# EAGLE design Datalogger-shield_V1.1 (EAGLE 5.11)
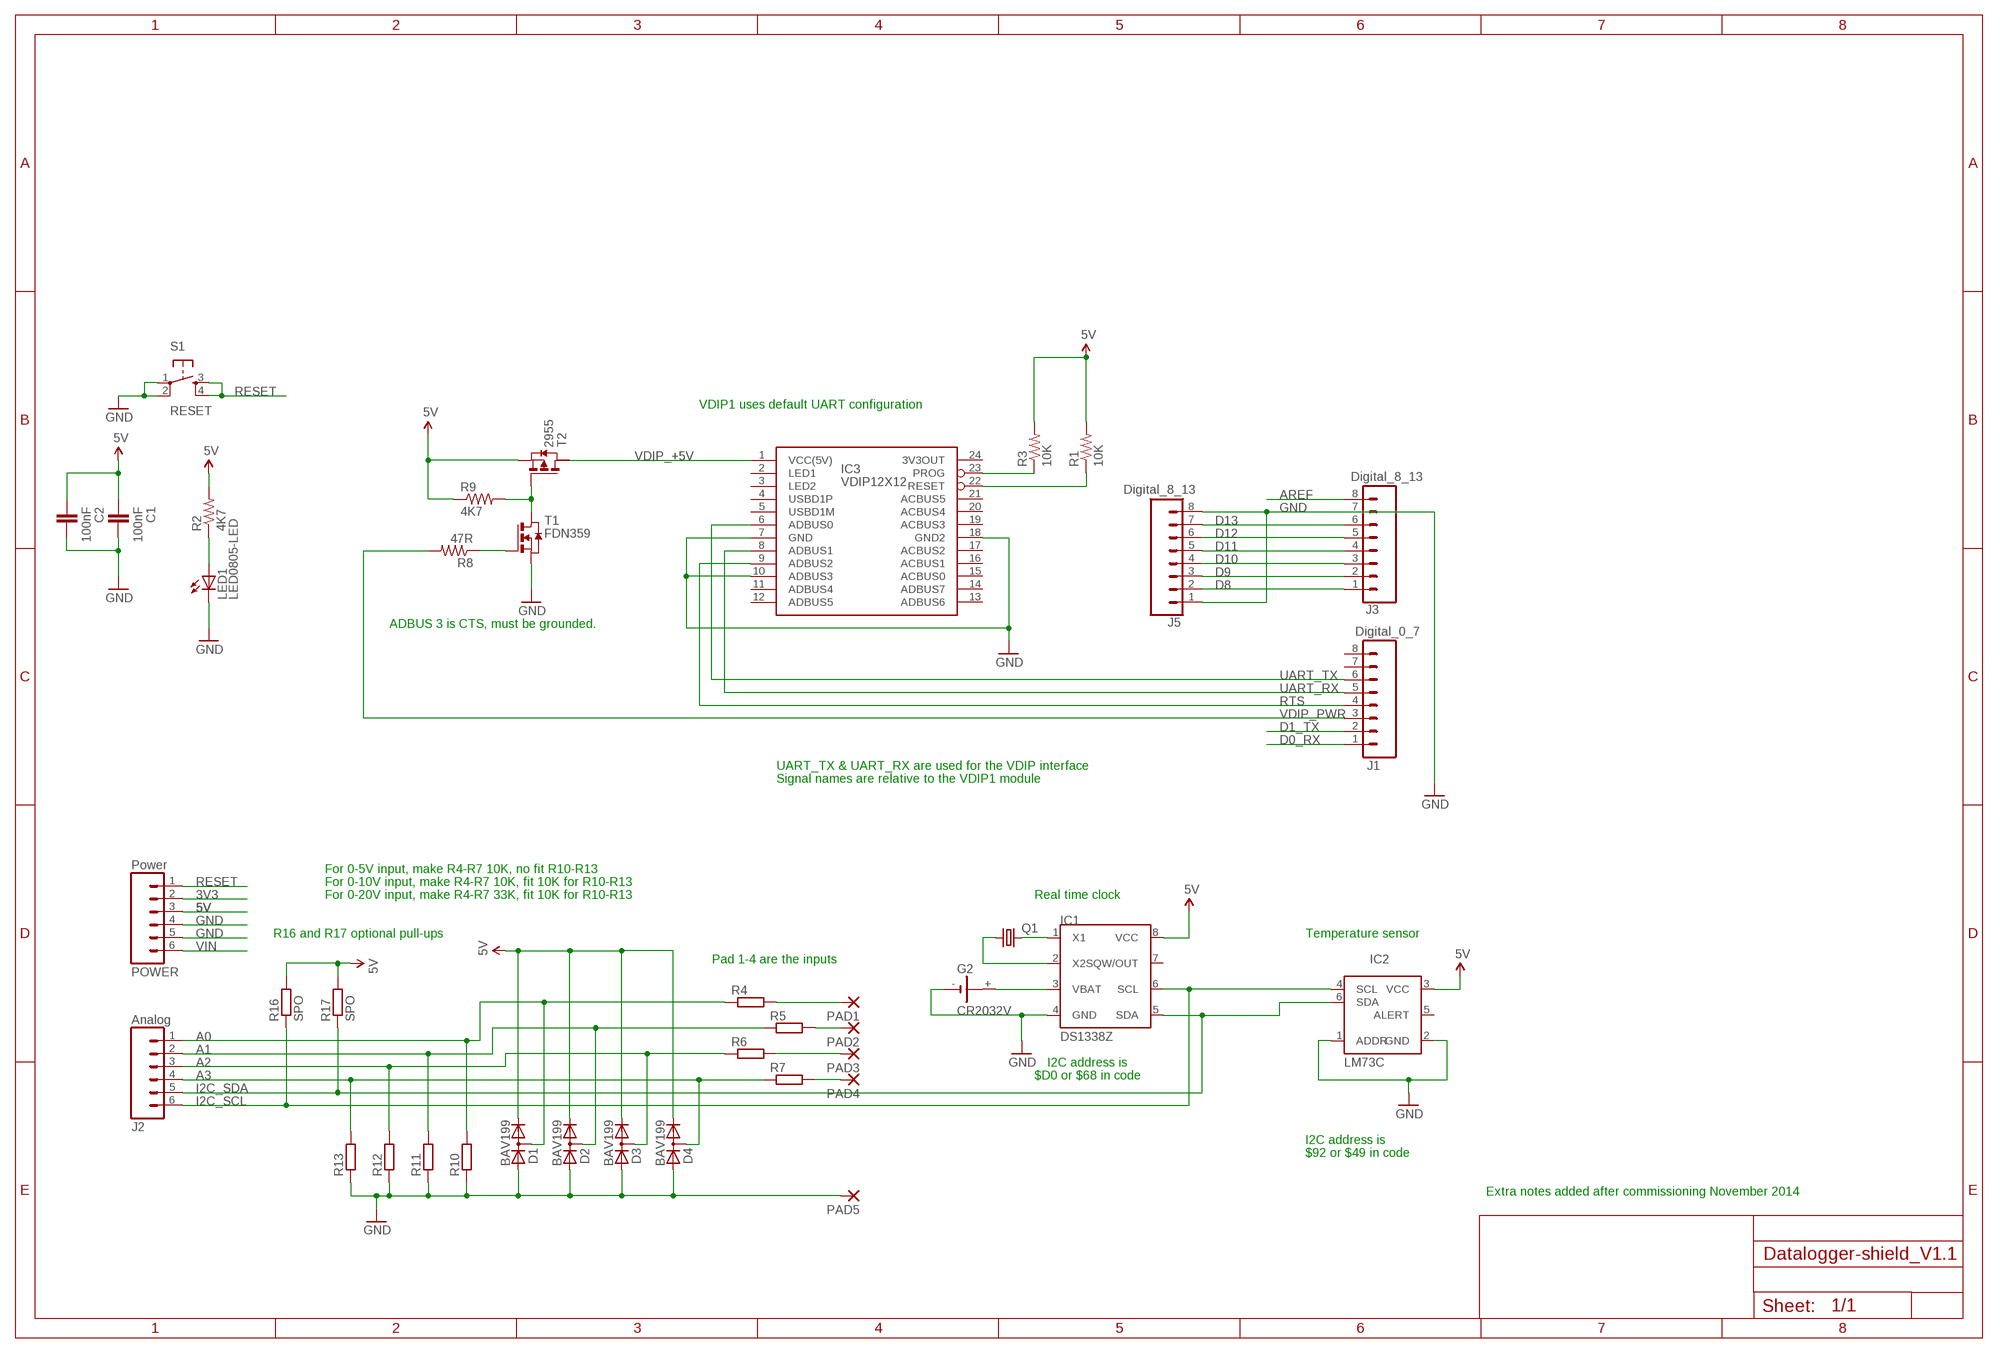
[diagram p0: schematic, sheet 1]

## Parts
C1  100nF  CAP0805-LARGE  [0805-LARGE]
C2  100nF  CAP0805-LARGE  [0805-LARGE]
D1  BAV199  [SOT23]
D2  BAV199  [SOT23]
D3  BAV199  [SOT23]
D4  BAV199  [SOT23]
G2  CR2032V  [CR2032V]
IC1  DS1338Z  DS1307  [SOIC-8]
IC2  LM73C  [SOT23-6L]
IC3  VDIP12X12  [VDIP1-2X12]
J1  Digital_0_7  M08  [1X08]
J2  Analog  M06SIP  [1X06]
J3  Digital_8_13  M08  [1X08]
J5  Digital_8_13  M08  [1X08]
LED1  LED0805-LED  [0805-LED]
PAD1  2,15/1,0  [2,15/1,0]
PAD2  2,15/1,0  [2,15/1,0]
PAD3  2,15/1,0  [2,15/1,0]
PAD4  2,15/1,0  [2,15/1,0]
PAD5  2,15/1,0  [2,15/1,0]
POWER  Power  M06SIP  [1X06]
Q1  CRYSTALTC26H  [TC26H]
R1  10K  RESISTOR0805-LARGE  [0805-LARGE]
R2  4K7  RESISTOR0805-LARGE  [0805-LARGE]
R3  10K  RESISTOR0805-LARGE  [0805-LARGE]
R4  R-EU_R0805  [R0805]
R5  R-EU_R0805  [R0805]
R6  R-EU_R0805  [R0805]
R7  R-EU_R0805  [R0805]
R8  47R  RESISTOR0805-LARGE  [0805-LARGE]
R9  4K7  RESISTOR0805-LARGE  [0805-LARGE]
R10  R-EU_R0805  [R0805]
R11  R-EU_R0805  [R0805]
R12  R-EU_R0805  [R0805]
R13  R-EU_R0805  [R0805]
R16  SPO  R-EU_R0805  [R0805]
R17  SPO  R-EU_R0805  [R0805]
S1  RESET  TAC_SWITCHPTH  [TACTILE-PTH]
T1  FDN359  NMOSSOT23  [SOT-23]
T2  2955  PMOSSOT223  [SOT223]

## Nets
3V3: POWER.2
5V: C1.1 C2.1 D1.2(C) D2.2(C) D3.2(C) D4.2(C) IC1.8(VCC) IC2.3(VCC) POWER.3 R1.2 R2.2 R3.2 R9.1 R16.2 R17.2 T2.3(S)
A0: D1.3(AC) J2.1 R4.1 R10.2
A1: D2.3(AC) J2.2 R5.1 R11.2
A2: D3.3(AC) J2.3 R6.1 R12.2
A3: D4.3(AC) J2.4 R7.1 R13.2
AREF: J3.8
D0_RX: J1.1
D1_TX: J1.2
D8: J3.1 J5.2
D9: J3.2 J5.3
D10: J3.3 J5.4
D11: J3.4 J5.5
D12: J3.5 J5.6
D13: J3.6 J5.7
GND: C1.2 C2.2 D1.1(A) D2.1(A) D3.1(A) D4.1(A) G2.- IC1.4(GND) IC2.1(ADDR) IC2.2(GND) IC3.7(GND) IC3.10(ADBUS3) IC3.18(GND2) J3.7 J5.1 J5.8 LED1.2(C) PAD5.1(P) POWER.4 POWER.5 R10.1 R11.1 R12.1 R13.1 S1.1 S1.2 T1.2(S)
I2C_SCL: IC1.6(SCL) IC2.4(SCL) J2.6 R16.1
I2C_SDA: IC1.5(SDA) IC2.6(SDA) J2.5 R17.1
N$1: IC3.22(RESET) R1.1
N$2: G2.+ IC1.3(VBAT)
N$3: PAD4.1(P) R7.2
N$4: PAD3.1(P) R6.2
N$5: IC1.1(X1) Q1.2
N$6: IC1.2(X2) Q1.1
N$9: PAD2.1(P) R5.2
N$10: PAD1.1(P) R4.2
N$12: R9.2 T1.1(D) T2.1(G)
N$13: R8.1 T1.3(G)
N$89: LED1.1(A) R2.1
N$137: IC3.23(PROG) R3.1
RESET: POWER.1 S1.3 S1.4
RTS: IC3.9(ADBUS2) J1.4
UART_RX: IC3.8(ADBUS1) J1.5
UART_TX: IC3.6(ADBUS0) J1.6
VDIP_+5V: IC3.1(VCC(5V)) T2.2(D)
VDIP_PWR: J1.3 R8.2
VIN: POWER.6
Unconnected: G2.+@1(+) IC1.7(SQW/OUT) IC2.5(ALERT) IC3.2(LED1) IC3.3(LED2) IC3.4(USBD1P) IC3.5(USBD1M) IC3.11(ADBUS4) IC3.12(ADBUS5) IC3.13(ADBUS6) IC3.14(ADBUS7) IC3.15(ACBUS0) IC3.16(ACBUS1) IC3.17(ACBUS2) IC3.19(ACBUS3) IC3.20(ACBUS4) IC3.21(ACBUS5) J1.7 J1.8 T2.4(D2)

## Notes on the sheet
- VDIP1 uses default UART configuration
- ADBUS 3 is CTS, must be grounded.
- UART_TX & UART_RX are used for the VDIP interface
- Signal names are relative to the VDIP1 module
- For 0-5V input, make R4-R7 10K, no fit R10-R13
- For 0-10V input, make R4-R7 10K, fit 10K for R10-R13
- For 0-20V input, make R4-R7 33K, fit 10K for R10-R13 | Real time clock
- R16 and R17 optional pull-ups | Temperature sensor
- Pad 1-4 are the inputs
- I2C address is
- $D0 or $68 in code
- I2C address is
- $92 or $49 in code
- Extra notes added after commissioning November 2014

## Power pins joined to a net without a drawn wire
3V3OUT: IC3.24(3V3OUT)

## Library data of the parts
C1 C2 = SparkFun:CAP: Capacitor Standard 0603 ceramic capacitor, and 0.1" leaded capacitor.
D1-D4 = diode:BAV199: DIODE low-leakage double diode
G2 = battery:CR2032V: LI BATTERY Varta
IC1 = dallas:DS1307: I2C Serial RTC w/56 bytes battery backed RAM
IC2 = IANS:LM73C: I2C/SMBUS Temperature sensor. 6 pin SOT 23 package. 1.0C accuracy and 11-14 bit resolution
IC3 = PracticalArduino:VDIP1
J1 J3 J5 = SparkFun:M08: Header 8 Standard 8-pin 0.1" header. Use with straight break away headers (SKU : PRT-00116), right angle break away headers (PRT-00553), swiss pins (PRT-00743), machine pins (PRT-00117), and female headers (PRT-00115).
J2 POWER = SparkFun:M06: Header 6 Standard 6-pin 0.1" header. Use with straight break away headers (SKU : PRT-00116), right angle break away headers (PRT-00553), swiss pins (PRT-00743), machine pins (PRT-00117), and female headers (PRT-00115). Molex polarized connector foot print use with SKU : PRT-08094 with associated crimp pins and housings. NOTES ON THE VARIANTS LOCK and LOCK_LONGPADS... This footprint was designed to help hold the alignment of a through-hole component (i.e. 6-pin header) while soldering it into place. You may notice that each hole has been shifted either up or down by 0.005 of an inch from it's more standard position (which is a perfectly straight line). This slight alteration caused the pins (the squares in the middle) to touch the edges of the holes. Because they are alternating, it causes a "brace" to hold the component in place. 0.005 has proven to be the perfect amount of "off-center" position when using our standard breakaway headers. Although looks a little odd when you look at the bare footprint, once you have a header in there, the alteration is very hard to notice. Also, if you push a header all the way into place, it is covered up entirely on the bottom side. This idea of altering the position of holes to aid alignment will be further integrated into the Sparkfun Library for other footprints. It can help hold any component with 3 or more connection pins.
LED1 = PracticalArduino:LED
PAD1-PAD5 = wirepad:2,15/1,0: THROUGH-HOLE PAD
Q1 = crystal:CRYSTAL: CRYSTAL; OC_FARNELL: unknown; OC_NEWARK: unknown
R1-R3 R8 R9 = SparkFun:RESISTOR: Resistor Basic schematic elements and footprints for 0603, 1206, and PTH 1/10th watt (small) resistors.
R4-R7 R10-R13 R16 R17 = rcl:R-EU_: RESISTOR, European symbol
S1 = SparkFun:TAC_SWITCH: Momentary Switch Button commonly used for reset or general input. Spark Fun Electronics SKU : COM-00097
T1 = zetex:NMOSSOT23: MOS FET; OC_FARNELL: unknown; OC_NEWARK: unknown
T2 = zetex:PMOSSOT223: MOS FET; OC_FARNELL: unknown; OC_NEWARK: unknown

## Board
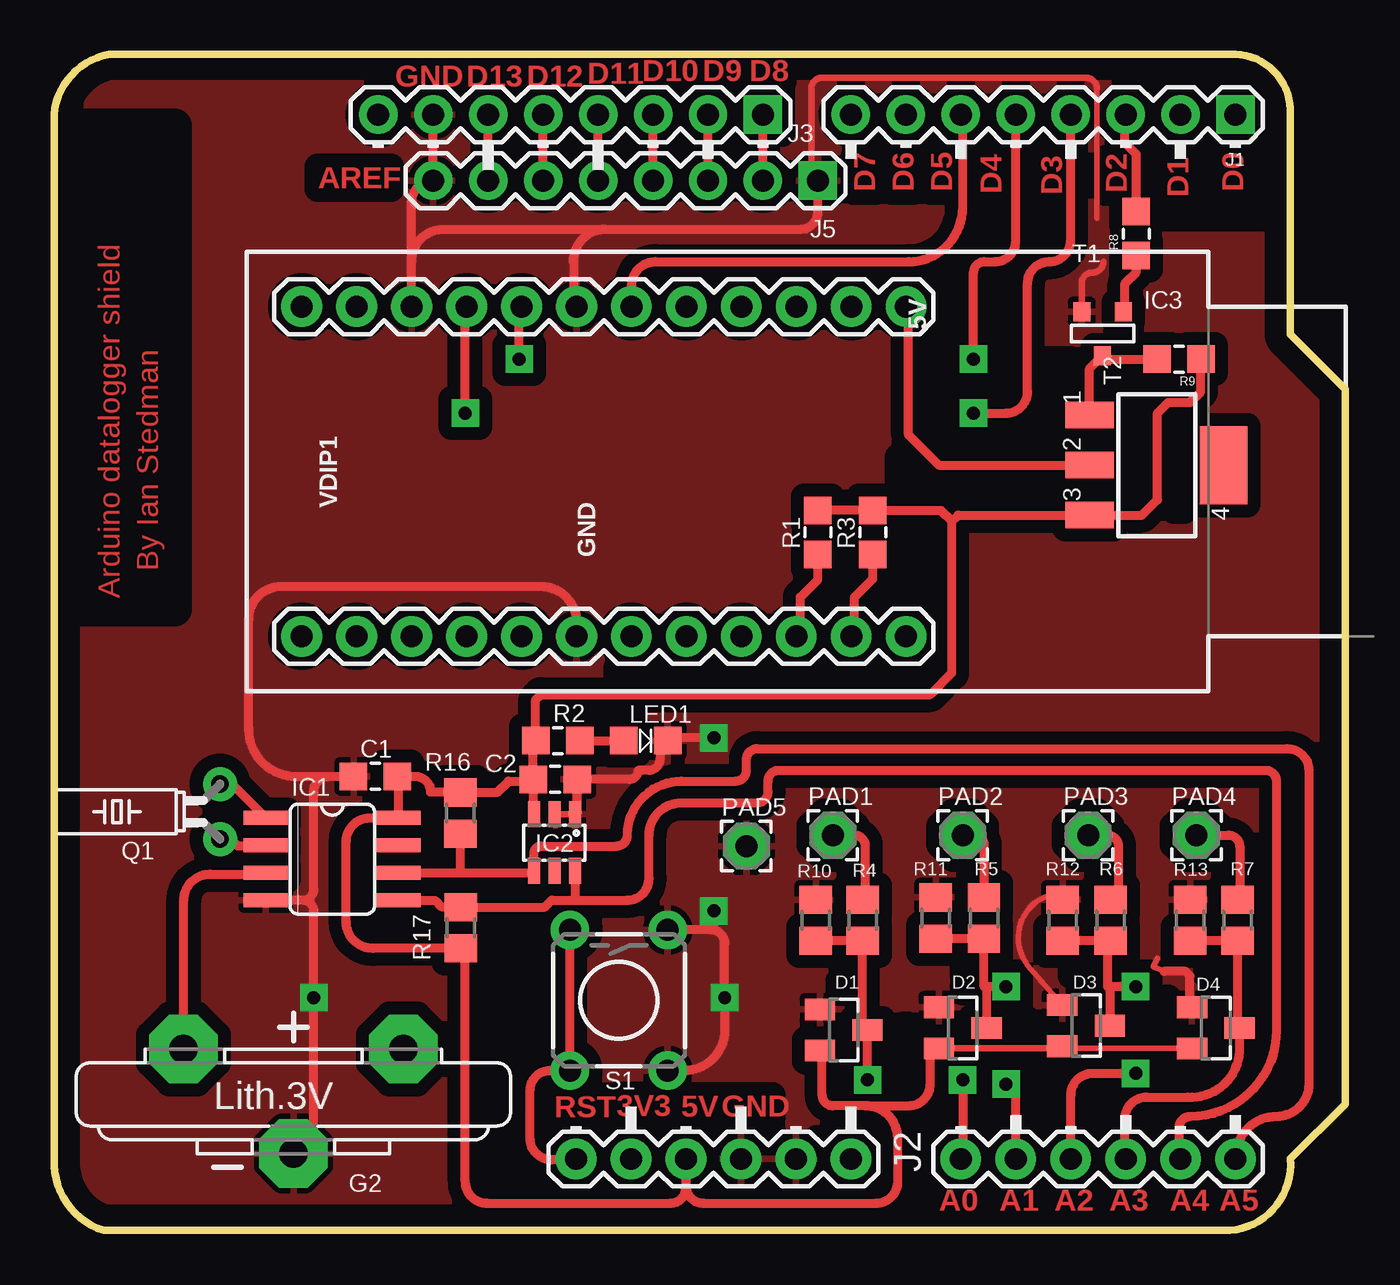
[diagram p1: board, top side]
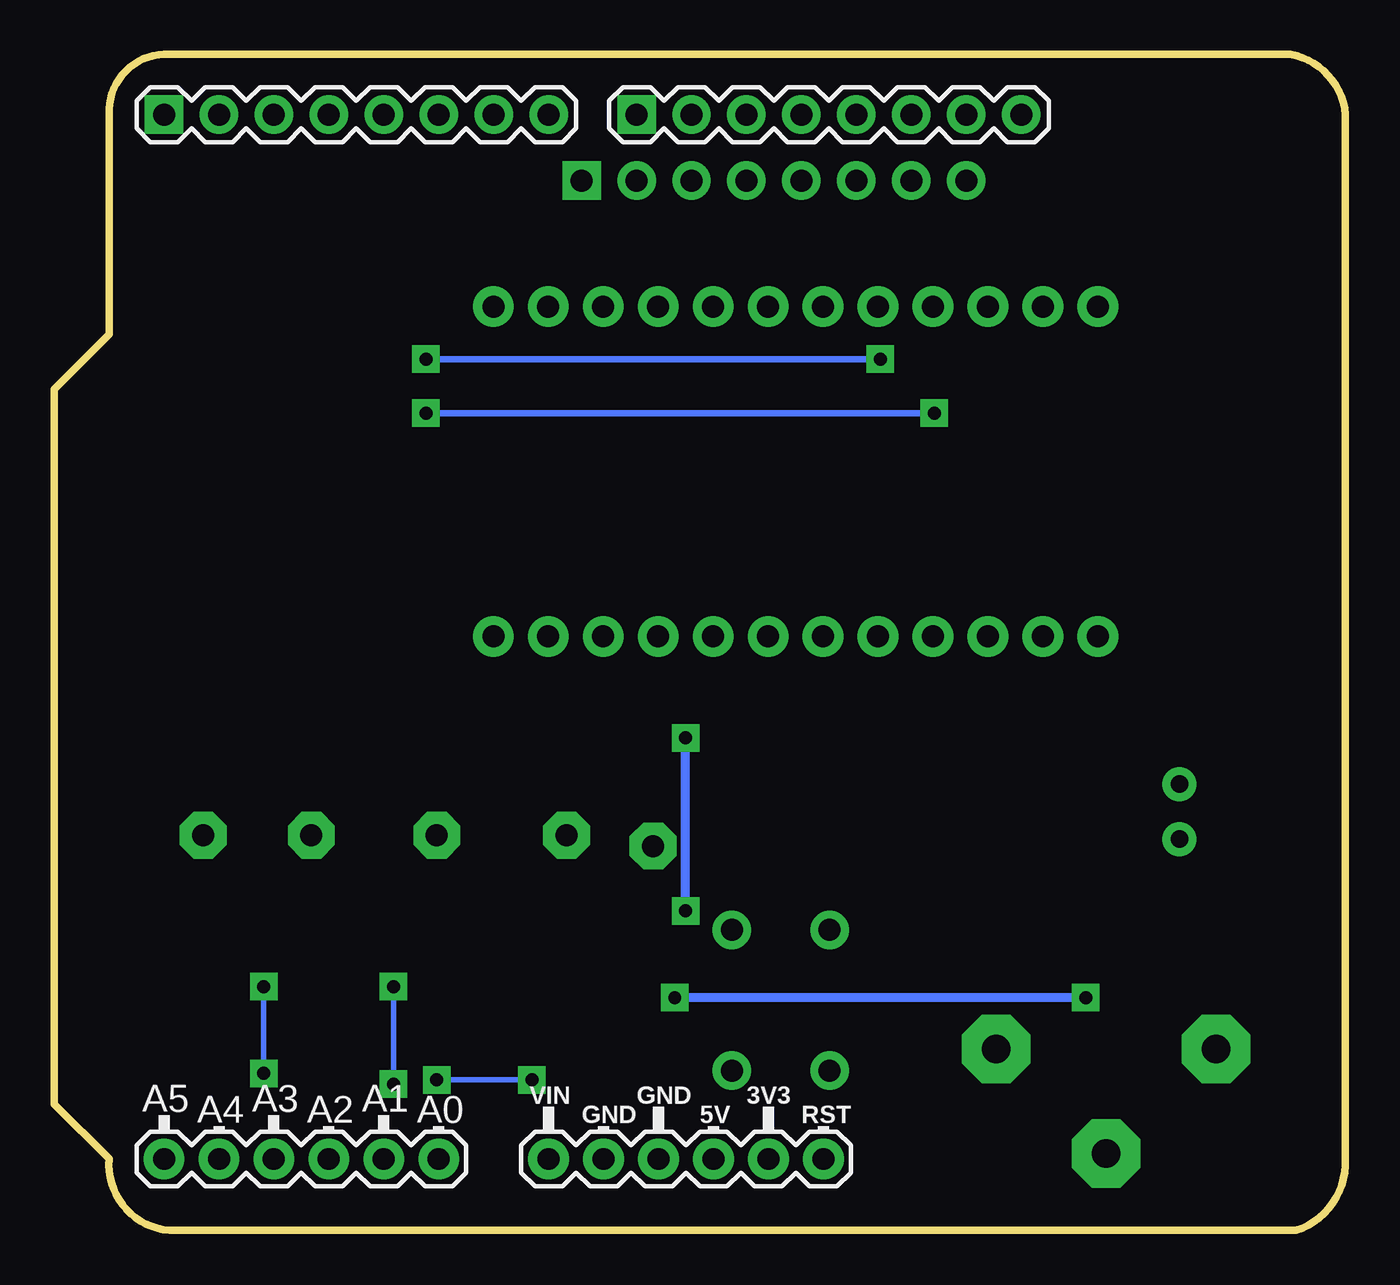
[diagram p2: board, bottom side, seen from below]

Size 59.69 x 54.36 mm. Coordinates in mm from the lower left corner, seen from the top.
Outline: 0,3.3 arc74 2.29,0 54.36,0 arc90 57.15,3.3 59.69,5.84 59.69,38.86 57.15,41.4 57.15,51.56 arc90 54.61,54.36 2.54,54.36 arc74 0,51.56 0,3.3
Copper layers (1*16): Top 0.035mm / dielectric 1.5mm / Bottom 0.035mm
Design rules "homepcb": minimum track width 10mil, minimum drill 20mil, track to track 10mil, track to pad 10mil, pad to pad 10mil, via to via 10mil, smd to smd 10mil, copper to edge 40mil, drill to drill 10mil, minimum pad ring 15mil, minimum via ring 10mil, stop-mask expansion 0mil, vias tented up to drill 0mil, thermal gap 10mil
tRestrict: area 1.3,28.7 to 5.6,51.1; area 46,39.8 to 47,40.3; area 39,34.8 to 39.5,35.8; area 51.5,46.8 to 56,47.3; area 53.5,10.8 to 54,11.3; area 50.5,9.8 to 51,10.3; area 47.5,10.8 to 48,11.3; area 44.5,9.3 to 45,9.8; area 42,11 to 42.2,11.3; area 42,11.8 to 42.2,12; area 47,11.8 to 47.2,12; area 51.2,10.5 to 51.5,10.8; 7 more areas

### Footprints (pad centres in the part's own frame; a part is rotated, then mirrored left to right if it is on the bottom)
0805-LARGE = smd 1.27 x 1.27: 1 -1.016,0; 2 1.016,0
SOT23 = smd 1 x 1.4: 1 -0.95,-1.1; 2 0.95,-1.1; 3 0,1.1
CR2032V = drill 1.321 pad 3.15 octagon: + -2.54,-5.08; +@1 -2.54,5.08; - 2.286,0
SOIC-8 = smd 2.032 x 0.66: 1 -3.073,1.27; 2 -3.073,0; 3 -3.073,-1.27; 4 -3.073,-2.54; 5 3.073,-2.54; 6 3.073,-1.27; 7 3.073,0; 8 3.073,1.27
SOT23-6L = smd 0.55 x 1.2: 1 -0.95,-1.3; 2 0,-1.3; 3 0.95,-1.3; 4 0.95,1.3; 5 0,1.3; 6 -0.95,1.3
VDIP1-2X12 = drill 1.016 pad 1.88 round: 1 -13.97,-7.62; 2 -11.43,-7.62; 3 -8.89,-7.62; 4 -6.35,-7.62; 5 -3.81,-7.62; 6 -1.27,-7.62; 7 1.27,-7.62; 8 3.81,-7.62; 9 6.35,-7.62; 10 8.89,-7.62; 11 11.43,-7.62; 12 13.97,-7.62; 13 13.97,7.62; 14 11.43,7.62; 15 8.89,7.62; 16 6.35,7.62; 17 3.81,7.62; 18 1.27,7.62; 19 -1.27,7.62; 20 -3.81,7.62; 21 -6.35,7.62; 22 -8.89,7.62; 23 -11.43,7.62; 24 -13.97,7.62
1X08 = drill 1.016 square: 1 0,0 | drill 1.016 round: 2 2.54,0; 3 5.08,0; 4 7.62,0; 5 10.16,0; 6 12.7,0; 7 15.24,0; 8 17.78,0
1X06 = drill 1.016 pad 1.88 round: 1 0,0; 2 2.54,0; 3 5.08,0; 4 7.62,0; 5 10.16,0; 6 12.7,0
0805-LED = smd 1.27 x 1.27: 1 -1.016,0; 2 1.016,0
2,15/1,0 = drill 1.016 pad 2.159 octagon: 1 0,0
TC26H = drill 0.813 round: 1 -1.27,0; 2 1.27,0
R0805 = smd 1.3 x 1.5: 1 -0.95,0; 2 0.95,0
TACTILE-PTH = drill 1.016 round: 1 -3.251,2.261; 2 3.251,2.261; 3 -3.251,-2.261; 4 3.251,-2.261
SOT-23 = smd 0.787 x 0.889: 1 0.025,-1.016; 2 -0.94,1.016; 3 0.991,1.016
SOT223 = smd 1.219 x 2.235: 1 -2.311,-3.099; 2 0,-3.099; 3 2.311,-3.099 | smd 3.6 x 2.2: 4 0,3.099

### Placement (x,y rotation side)
C1  14.85,20.99 180 top
C2  23.16,20.84 0 top
D1  36.5,9.26 270 top
D2  42,9.36 270 top
D3  47.7,9.46 270 top
D4  53.7,9.36 270 top
G2  11.06,5.84 270 top
IC1  12.86,17.8 0 top
IC2  23.13,17.92 180 top
IC3  25.42,35.07 180 top
J1  54.61,51.56 180 top
J2  41.91,3.3 0 top
J3  32.77,51.56 180 top
J5  35.31,48.51 180 top
LED1  27.35,22.63 0 top
PAD1  36,18.26 0 top
PAD2  42,18.26 0 top
PAD3  47.8,18.26 0 top
PAD4  52.8,18.26 0 top
PAD5  32,17.76 0 top
POWER  24.13,3.3 0 top
Q1  7.67,19.35 90 top
R1  35.31,32.26 90 top
R2  23.28,22.63 180 top
R3  37.85,32.26 90 top
R4  37.37,14.34 90 top
R5  42.98,14.44 90 top
R6  48.84,14.34 90 top
R7  54.71,14.34 90 top
R8  50.02,46.06 90 top
R9  52,40.26 180 top
R10  35.21,14.34 270 top
R11  40.76,14.44 270 top
R12  46.62,14.34 270 top
R13  52.51,14.34 270 top
R16  18.78,19.29 90 top
R17  18.8,13.99 270 top
S1  26.1,10.64 270 top
T1  48.44,41.44 0 top
T2  50.96,35.36 270 top

### Tracks (layer width: path | path; a pad name or v marks a point on that pad's centre or on a via)
5V
  Top 0.254: D3.2 46.5,8.41 D4.2
  Top 0.305: 46.35,8.46 D3.2 arc-90 46.3,8.41 D2.2 | D4.2 arc-90 52.45,8.26
  Top 0.406: C2.1 22.07,20.76 21,20.76 20.48,20.24 R16.2 arc90 18.76,20.26 17.4,20.26 arc90 16.68,20.99 C1.1 arc-90 15.93,20.92 IC1.8 arc-90 IC1.8 14.6,19.06 arc90 13.5,17.96 13.5,14.26 arc90 14.73,13.04 R17.2 arc-90 19,12.83 19,2.26 arc90 20,1.26 28.5,1.26 arc90 29.21,1.97 POWER.3 29.21,2.05 arc90 30,1.26 38,1.26 arc90 39,2.26 39,4.26 arc90 37.5,5.76 | C2.1 22.15,19.26 IC2.3 | C2.1 22.15,22.51 R2.2 22.27,24.53 22.5,24.76 40.5,24.76 41.5,25.76 41.5,32.76 | 41.5,32.76 41,33.26 R3.2 R1.2 | 37.5,5.76 36,5.76 arc-90 35.5,6.26 35.5,8.21 arc90 D1.2 | 37.5,5.76 39.5,5.76 arc90 40.5,6.76 40.5,8.01 arc-90 D2.2 | 41.5,32.76 41.79,33.05 47,33.05 T2.3 50.29,33.05 51,33.76 51,37.76 51.5,38.26 52.5,38.26 53,38.76 53,40.25 R9.1
A0  (via drill 0.6 pad 1.27)
  Top 0.406: R10.2 R4.1 37.37,9.5 arc90 D1.3 v37.6,6.96 | 42,3.39 arc-90 J2.1 arc90 42,3.39 | v42,6.96 42,3.39
  Bottom 0.254: v37.6,6.96 v42,6.96
A1  (via drill 0.6 pad 1.27)
  Top 0.305: 42.98,11.28 arc90 43,11.26 43.1,11.16
  Top 0.406: R11.2 R5.1 42.98,11.28 | 42.98,9.48 arc90 D2.3 43.1,11.16 | v44,11.26 43,11.26 | v44,6.76 44.45,6.31 J2.2
  Bottom 0.254: v44,6.76 v44,11.26
A2  (via drill 0.6 pad 1.27)
  Top 0.254: 46.99,6.25 arc-90 47,6.26 | 48.7,11.26 arc-90 48.8,11.16
  Top 0.305: 48.7,13.24 R6.1
  Top 0.406: R6.1 R12.2 | 48.84,9.51 arc-90 D3.3 48.8,11.16 | 48.7,13.24 48.7,11.26 v50,11.26 | v50,7.26 48,7.26 arc90 47,6.26 | J2.3 46.99,6.25
  Bottom 0.254: v50,7.26 v50,11.26
A3
  Top 0.406: R13.2 R7.1 54.71,9.45 arc90 D4.3 54.8,8.26 arc-90 52.4,6.16 50.5,6.16 arc90 49.5,5.16 49.5,3.33 arc90 J2.4
D8
  Top 0.406: J5.2 J3.1
D9
  Top 0.406: J5.3 J3.2
D10
  Top 0.406: J5.4 J3.3
D11
  Top 0.406: J5.5 J3.4
D12
  Top 0.406: J5.6 J3.5
D13
  Top 0.406: J5.7 J3.6
GND  (via drill 0.6 pad 1.27)
  Top 0.254: D3.1 45,12.26 arc-93 45.5,15.26 arc-65 R12.1 | 48.2,52.76 48.2,46.76 | 51.32,11.97 50.8,12.19 51,12.58
  Top 0.305: IC2.1 IC2.2 | T1.2 arc-90 T1.2 | T1.2 47.5,43.76 arc-90 48,44.26 arc90 48.5,44.76 | 48.2,52.76 arc90 47.7,53.26 35.5,53.26 arc90 35,52.76 35,48.82 arc90 J5.1
  Top 0.406: v30.5,22.76 28.49,22.76 LED1.2 | LED1.2 28.5,22.49 | IC2.1 24.18,19.32 C2.2 26.58,20.84 arc90 27,21.26 27.5,21.26 arc90 28,21.76 28,22.27 arc-90 LED1.2 | G2.- arc90 12,4.49 v12,10.76 12,14.76 arc90 11.5,15.26 | 11.5,15.26 11,15.26 arc-90 10.99,15.26 IC1.4 | 11.5,15.26 arc90 12,15.76 12,20.26 arc-90 12.72,20.99 C1.2 arc-90 13.81,20.96 11.2,20.96 arc-90 9,23.16 9,28.26 arc-90 10.5,29.76 22.5,29.76 arc-90 24.15,28.12 IC3.18 | J3.7 J5.8 arc90 16.53,47.51 IC3.10 16.53,44.79 arc-90 18,46.26 25.5,46.26 | J5.1 35.31,47.07 arc-90 34.5,46.26 25.5,46.26 | 25.5,46.26 arc90 24,44.76 24,42.83 arc90 IC3.7 | S1.2 29.12,7.38 arc90 31,9.26 v31,10.76 31,13.26 arc90 30.38,13.89 | 30.38,13.89 S1.1 | v30.5,14.76 30.5,14.01 arc-90 30.38,13.89 | 51.32,11.97 52.29,11.97 52.5,11.76 52.5,10.41 D4.1
  Bottom 0.406: v30.5,14.76 v30.5,22.76 | v12,10.76 v31,10.76
  pour Top (isolate 0.61): 0.51,51.05 arc-90 3.05,54.1 54.36,54.1 arc-90 56.9,52.07 56.9,41.15 arc90 57.15,40.89 57.15,40.64 59.18,38.61 59.18,5.84 59.44,5.59 59.18,5.59 56.9,3.3 56.9,2.54 55.63,0.76 2.03,0.76 0.51,2.79
I2C_SCL
  Top 0.406: IC1.6 18.8,16.53 | 18.8,16.53 22.08,16.53 IC2.4 22.18,17.44 arc-90 22.5,17.76 26,17.76 arc90 26.5,18.26 arc-90 29,20.76 31.5,20.76 arc90 32,21.26 32,21.76 arc-90 32.5,22.26 57,22.26 arc-90 58,21.26 58,6.76 arc-90 56.5,5.26 arc92 J2.6 | R16.1 18.78,16.54 18.8,16.53
I2C_SDA
  Top 0.305: 52,3.37 J2.5
  Top 0.406: IC1.5 17.61,15.26 17.9,14.96 18.77,14.96 R17.1 22.67,14.94 23,15.26 24.1,15.26 | 24.1,15.26 24.1,16.6 IC2.6 | 52,3.37 52,4.26 52,4.76 arc-90 52.5,5.26 arc90 56.5,9.26 56.5,20.76 arc90 56,21.26 33.5,21.26 arc90 33,20.76 33,20.26 arc-90 32.5,19.76 29,19.76 | 24.1,15.26 26.5,15.26 arc90 27.5,16.26 27.5,18.26 | 27.5,18.26 arc-90 29,19.76 | 27.5,18.26 arc-90 29,19.76 | 27.5,18.26 arc-90 29,19.76
N$1
  Top 0.406: R1.1 35.31,30.07 34.5,29.26 34.5,27.64 IC3.22
N$2
  Top 0.406: IC1.3 9.72,16.46 7.2,16.46 arc90 6,15.26 6,8.4 arc-90 G2.+
N$3
  Top 0.406: PAD4.1 54.3,18.26 arc-90 54.8,17.76 54.8,15.38 arc-90 R7.2
N$4
  Top 0.406: PAD3.1 48.7,18.26 arc-90 49.2,17.76 49.2,15.64 arc-90 R6.2
N$5
  Top 0.406: Q1.2 8.23,20.62 IC1.1
N$6
  Top 0.305: IC1.2 9.75,17.76
  Top 0.406: Q1.1 8.18,18.08 8.5,17.76 9.75,17.76
N$9
  Top 0.406: PAD2.1 42.5,18.26 arc-90 43,17.76 43,15.41 arc-90 R5.2
N$10
  Top 0.406: PAD1.1 37,18.26 arc-90 37.5,17.76 37.5,15.42 arc-90 R4.2
N$12
  Top 0.406: T2.1 47.87,39.82 T1.1 48.62,40.26 R9.2
N$13
  Top 0.406: R8.1 50.02,44.28 49.5,43.76 49.5,42.52 T1.3
N$89
  Top 0.406: R2.1 LED1.1
N$137
  Top 0.406: R3.1 37.85,30.11 37,29.26 37,27.6 IC3.23
RESET
  Top 0.406: POWER.1 arc-90 24.09,3.26 23,3.26 arc-90 22,4.26 22,6.46 arc-90 22.92,7.38 S1.4 S1.3
RTS  (via drill 0.6 pad 1.27)
  Top 0.305: 19,42.62 IC3.9 arc90 19,42.62
  Top 0.406: J1.4 46.99,45.75 arc-90 46,44.76 arc90 45,43.76 45,38.76 arc-90 44,37.76 v42.5,37.76 | v19,37.76 19,42.62
  Bottom 0.305: v19,37.76 v42.5,37.76
UART_RX  (via drill 0.6 pad 1.27)
  Top 0.305: 21.5,42.58 IC3.8
  Top 0.406: v21.5,40.26 21.5,42.58 | J1.5 44.45,45.71 arc-90 43.5,44.76 43,44.76 arc90 42.5,44.26 v42.5,40.26
  Bottom 0.305: v21.5,40.26 v42.5,40.26
UART_TX
  Top 0.305: 42,51.47 J1.6
  Top 0.406: 42,51.47 42,47.26 arc-90 39.5,44.76 27.8,44.76 arc90 26.7,43.66 IC3.6 arc-90 IC3.6
VDIP_+5V
  Top 0.406: IC3.1 39.5,42.57 39.5,36.76 40.9,35.36 T2.2
VDIP_PWR
  Top 0.406: R8.2 50.02,49.74 49.5,50.26 49.5,51.53 J1.3

### Text on the board
Top: GND | D13 | D12 | D11 | D10 | D9 | D8 | A | REF | D7 | D6 | D5 | D4 | D3 | D2 | D1 | D0 | By Ian Stedman | Arduino datalogger shield | RST | 3V3 | 5V | GND | A0 | A1 | A2 | A3 | A4 | A5
tPlace: 5V | VDIP1 | GND
bPlace: 3V3 | GND | VIN | A1 | A3 | A5 | RST | 5V | GND | A0 | A2 | A4